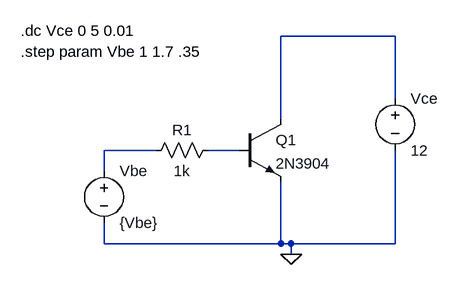
[diagram p0: schematic npn_2n3904.asc]
npn_2n3904.asc, the LTspice schematic file:
Version 4
SHEET 1 880 680
WIRE 384 -16 208 -16
WIRE 384 80 384 -16
WIRE 208 112 208 -16
WIRE 16 160 -64 160
WIRE 144 160 96 160
WIRE -64 192 -64 160
WIRE -64 304 -64 272
WIRE 208 304 208 208
WIRE 208 304 -64 304
WIRE 224 304 208 304
WIRE 384 304 384 160
WIRE 384 304 224 304
WIRE 224 320 224 304
FLAG 224 320 0
SYMBOL npn 144 112 R0
SYMATTR InstName Q1
SYMATTR Value 2N3904
SYMBOL voltage 384 64 R0
SYMATTR InstName Vce
SYMATTR Value 12
SYMBOL voltage -64 176 R0
WINDOW 123 0 0 Left 0
WINDOW 39 0 0 Left 0
SYMATTR InstName Vbe
SYMATTR Value {Vbe}
SYMBOL res 112 144 R90
WINDOW 0 0 56 VBottom 2
WINDOW 3 32 56 VTop 2
SYMATTR InstName R1
SYMATTR Value 1k
TEXT -192 -24 Left 2 !.dc Vce 0 5 0.01
TEXT -192 8 Left 2 !.step param Vbe 1 1.7 .35

The netlist it stands for:
* npn_2n3904.asc
Q1 N001 N003 0 0 2N3904
Vce N001 0 12
Vbe N002 0 {Vbe}
R1 N003 N002 1k
.model NPN NPN
.model PNP PNP
.lib standard.bjt
.dc Vce 0 5 0.01
.step param Vbe 1 1.7 .35
.backanno
.end